# Altium schematic sheet Top_level.SchDoc: Top Level
size A4; DocumentNumber: 1; Revision: v1; SheetNumber: 1; SheetTotal: 4
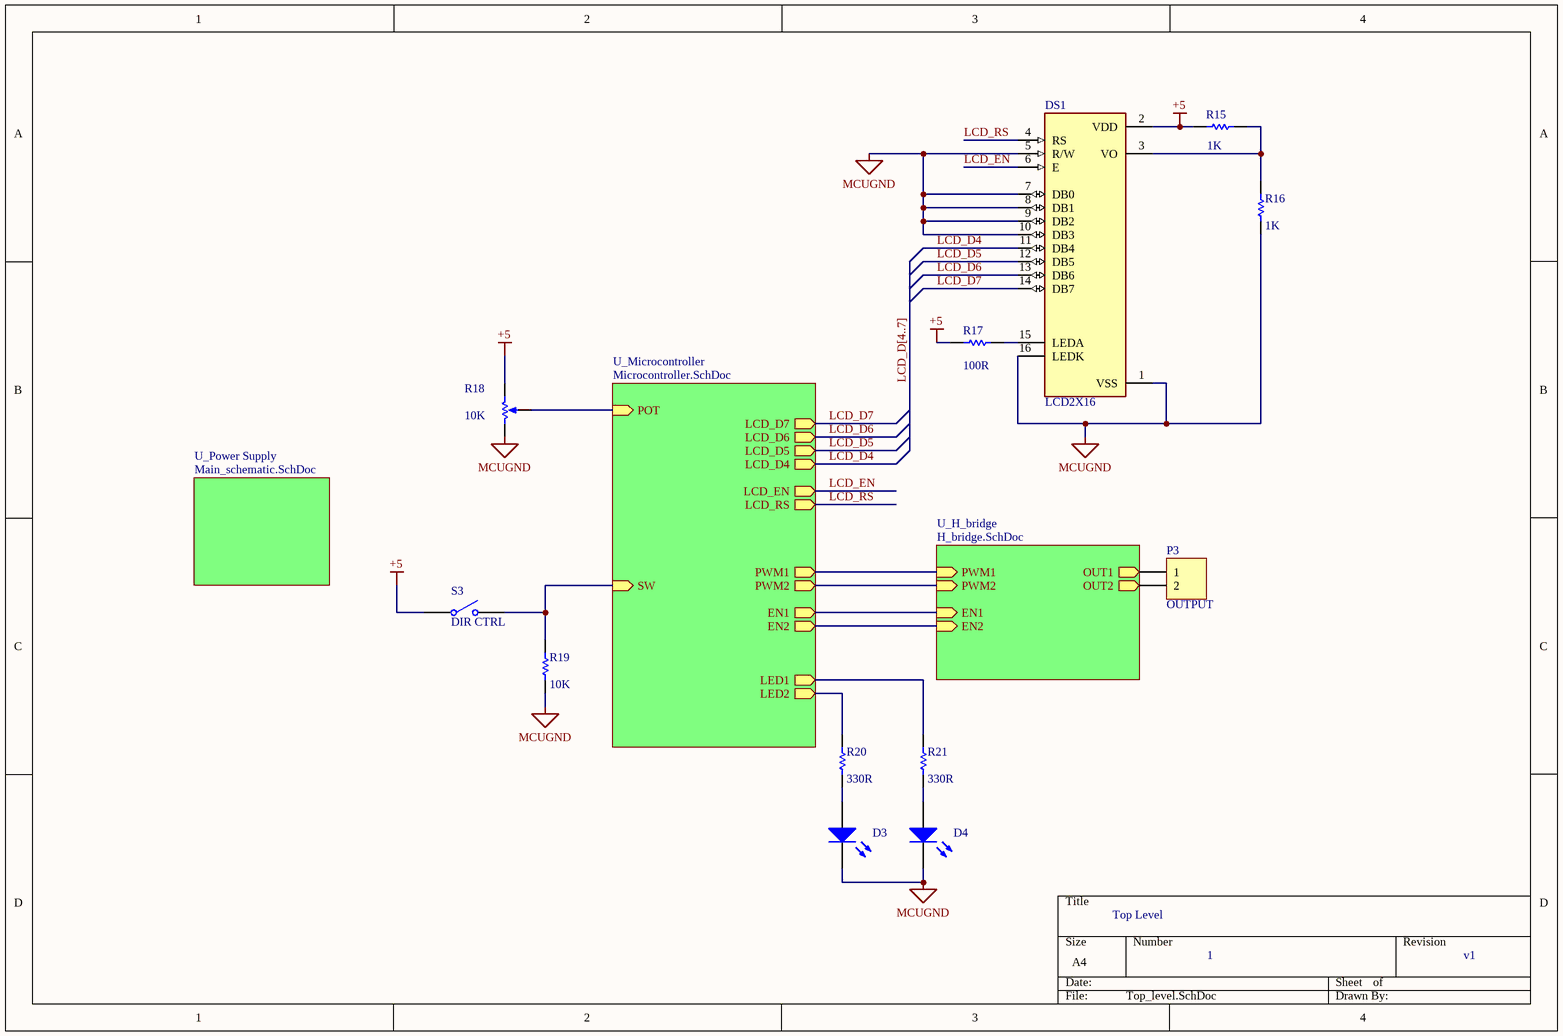
[diagram p0: Top_level.SchDoc]

## Parts
D3  LED1  [LED-1]  (value not drawn)
D4  LED1  [LED-1]  (value not drawn)
DS1  LCD2X16  [LCD_LCD2X16]
P3  OUTPUT  [HDR1X2]
R15  value 1K  [AXIAL-0.3]  (hidden comment: Res1)
R16  value 1K  [AXIAL-0.3]  (hidden comment: Res1)
R17  value 100R  [AXIAL-0.3]  (hidden comment: Res1)
R18  value 10K  [VR5]  (hidden comment: RPot)
R19  value 10K  [AXIAL-0.3]  (hidden comment: Res1)
R20  value 330R  [AXIAL-0.3]  (hidden comment: Res1)
R21  value 330R  [AXIAL-0.3]  (hidden comment: Res1)
S3  DIR CTRL  [SPST-2]

## Sub-sheets
U_H_bridge = H_bridge.SchDoc: PWM1 (in), PWM2 (in), EN1 (in), EN2 (in), OUT1 (out), OUT2 (out)
U_Microcontroller = Microcontroller.SchDoc: POT (in), SW (in), PWM1 (out), PWM2 (out), LED1 (out), EN1 (out), EN2 (out), LCD_D6 (out), LCD_D5 (out), LCD_D7 (out), LCD_D4 (out), LCD_RS (out), LCD_EN (out), LED2 (out)
U_Power Supply = Main_schematic.SchDoc: no entries

## Nets
+5: DS1.2(VDD) R15.1 R17.1 R18.1(TOP) S3.1(COMMON)
MCUGND: D3.2(K) D4.2(K) DS1.1(VSS) DS1.5(R/W) DS1.7(DB0) DS1.8(DB1) DS1.9(DB2) DS1.10(DB3) DS1.16(LEDK) R16.1 R18.2(BOT) R19.1
LCD_D4: DS1.11(DB4) ; sheet U_Microcontroller/LCD_D4
LCD_D5: DS1.12(DB5) ; sheet U_Microcontroller/LCD_D5
LCD_D6: DS1.13(DB6) ; sheet U_Microcontroller/LCD_D6
LCD_D7: DS1.14(DB7) ; sheet U_Microcontroller/LCD_D7
LCD_EN: DS1.6(E) ; sheet U_Microcontroller/LCD_EN
LCD_RS: DS1.4(RS) ; sheet U_Microcontroller/LCD_RS
NetD3_1: D3.1(A) R20.1
NetD4_1: D4.1(A) R21.1
NetDS1_3: DS1.3(VO) R15.2 R16.2
NetDS1_15: DS1.15(LEDA) R17.2
NetP3_1: P3.1 ; sheet U_H_bridge/OUT1
NetP3_2: P3.2 ; sheet U_H_bridge/OUT2
NetR18_3: R18.3(TAP) ; sheet U_Microcontroller/POT
NetR19_2: R19.2 S3.2(NO) ; sheet U_Microcontroller/SW
NetR20_2: R20.2 ; sheet U_Microcontroller/LED2
NetR21_2: R21.2 ; sheet U_Microcontroller/LED1
(unnamed): sheet U_Microcontroller/PWM1, sheet U_H_bridge/PWM1
(unnamed): sheet U_Microcontroller/PWM2, sheet U_H_bridge/PWM2
(unnamed): sheet U_Microcontroller/EN1, sheet U_H_bridge/EN1
(unnamed): sheet U_Microcontroller/EN2, sheet U_H_bridge/EN2

## Buses and harness runs
bus LCD_D[4..7]

## Library data of the parts
D3 D4 = LED1: Typical RED GaAs LED; Published: 8-Jun-2000; LatestRevisionDate: 08-Jul-2005; LatestRevisionNote: Mech Layer 1 removed.; PackageReference: LED-1; Publisher: Altium Limited; PackageDescription: LED; 2 Leads
DS1 = LCD2X16: Display; Display: LCD 2x16 characters (blue backlight); MF: mikroElektronika; SnapEDA_Link: https://www.snapeda.com/parts/LCD2X16/mikroElektronika/view-part/2472530/?ref=snap; Price: None; Package: None; Availability: Unavailable; Value: *; MP: LCD2X16
P3 = Header 2: Header, 2-Pin; LatestRevisionDate: 17-Jul-2002; LatestRevisionNote: Re-released for DXP Platform.; Publisher: Altium Limited
R15-R17 R19-R21 = Res1: Resistor; Published: 8-Jun-2000; LatestRevisionDate: 17-Jul-2002; LatestRevisionNote: Re-released for DXP Platform.; PackageReference: AXIAL-0.3; Publisher: Altium Limited; PackageDescription: Axial Device, Thru-Hole; 2 Leads; 0.3 in Pin Spacing
R18 = RPot: Potentiometer; Sim Note: Enter the Resistance value and the set point into parameter fields.; Set Position: 0.5; Published: 8-Jun-2000; LatestRevisionDate: 17-Jul-2002; LatestRevisionNote: Re-released for DXP Platform.; PackageReference: VR5; Publisher: Altium Limited; PackageDescription: Variable Resistor, Thru-Hole; 3 Leads
S3 = SW-SPST: Single-Pole, Single-Throw Switch; Published: 24-Mar-1999; LatestRevisionDate: 17-Jul-2002; LatestRevisionNote: Re-released for DXP Platform.; PackageReference: SPST-2; Publisher: Altium Limited; PackageDescription: Switch; 2 Leads